# Altium schematic sheet DigitalPart.SchDoc: Плата АЦП - общая часть
size 330 x 381 mm; PageSetup: Record=PageOptions|CenterHorizontal=True|CenterVertical=True|PrintScale=0.82|XCorrection=1.00|YCorrection=1.00|PrintKind=2|BorderSize=5000000|LeftOffset=0|BottomOffset=0|Orientation=1|PaperLength=1000|PaperWidth=1000|Scale=100|PaperSource=7|PrintQuality=-4|MediaType=1|DitherType=10|PaperKind=A3|PrintScaleMode=1
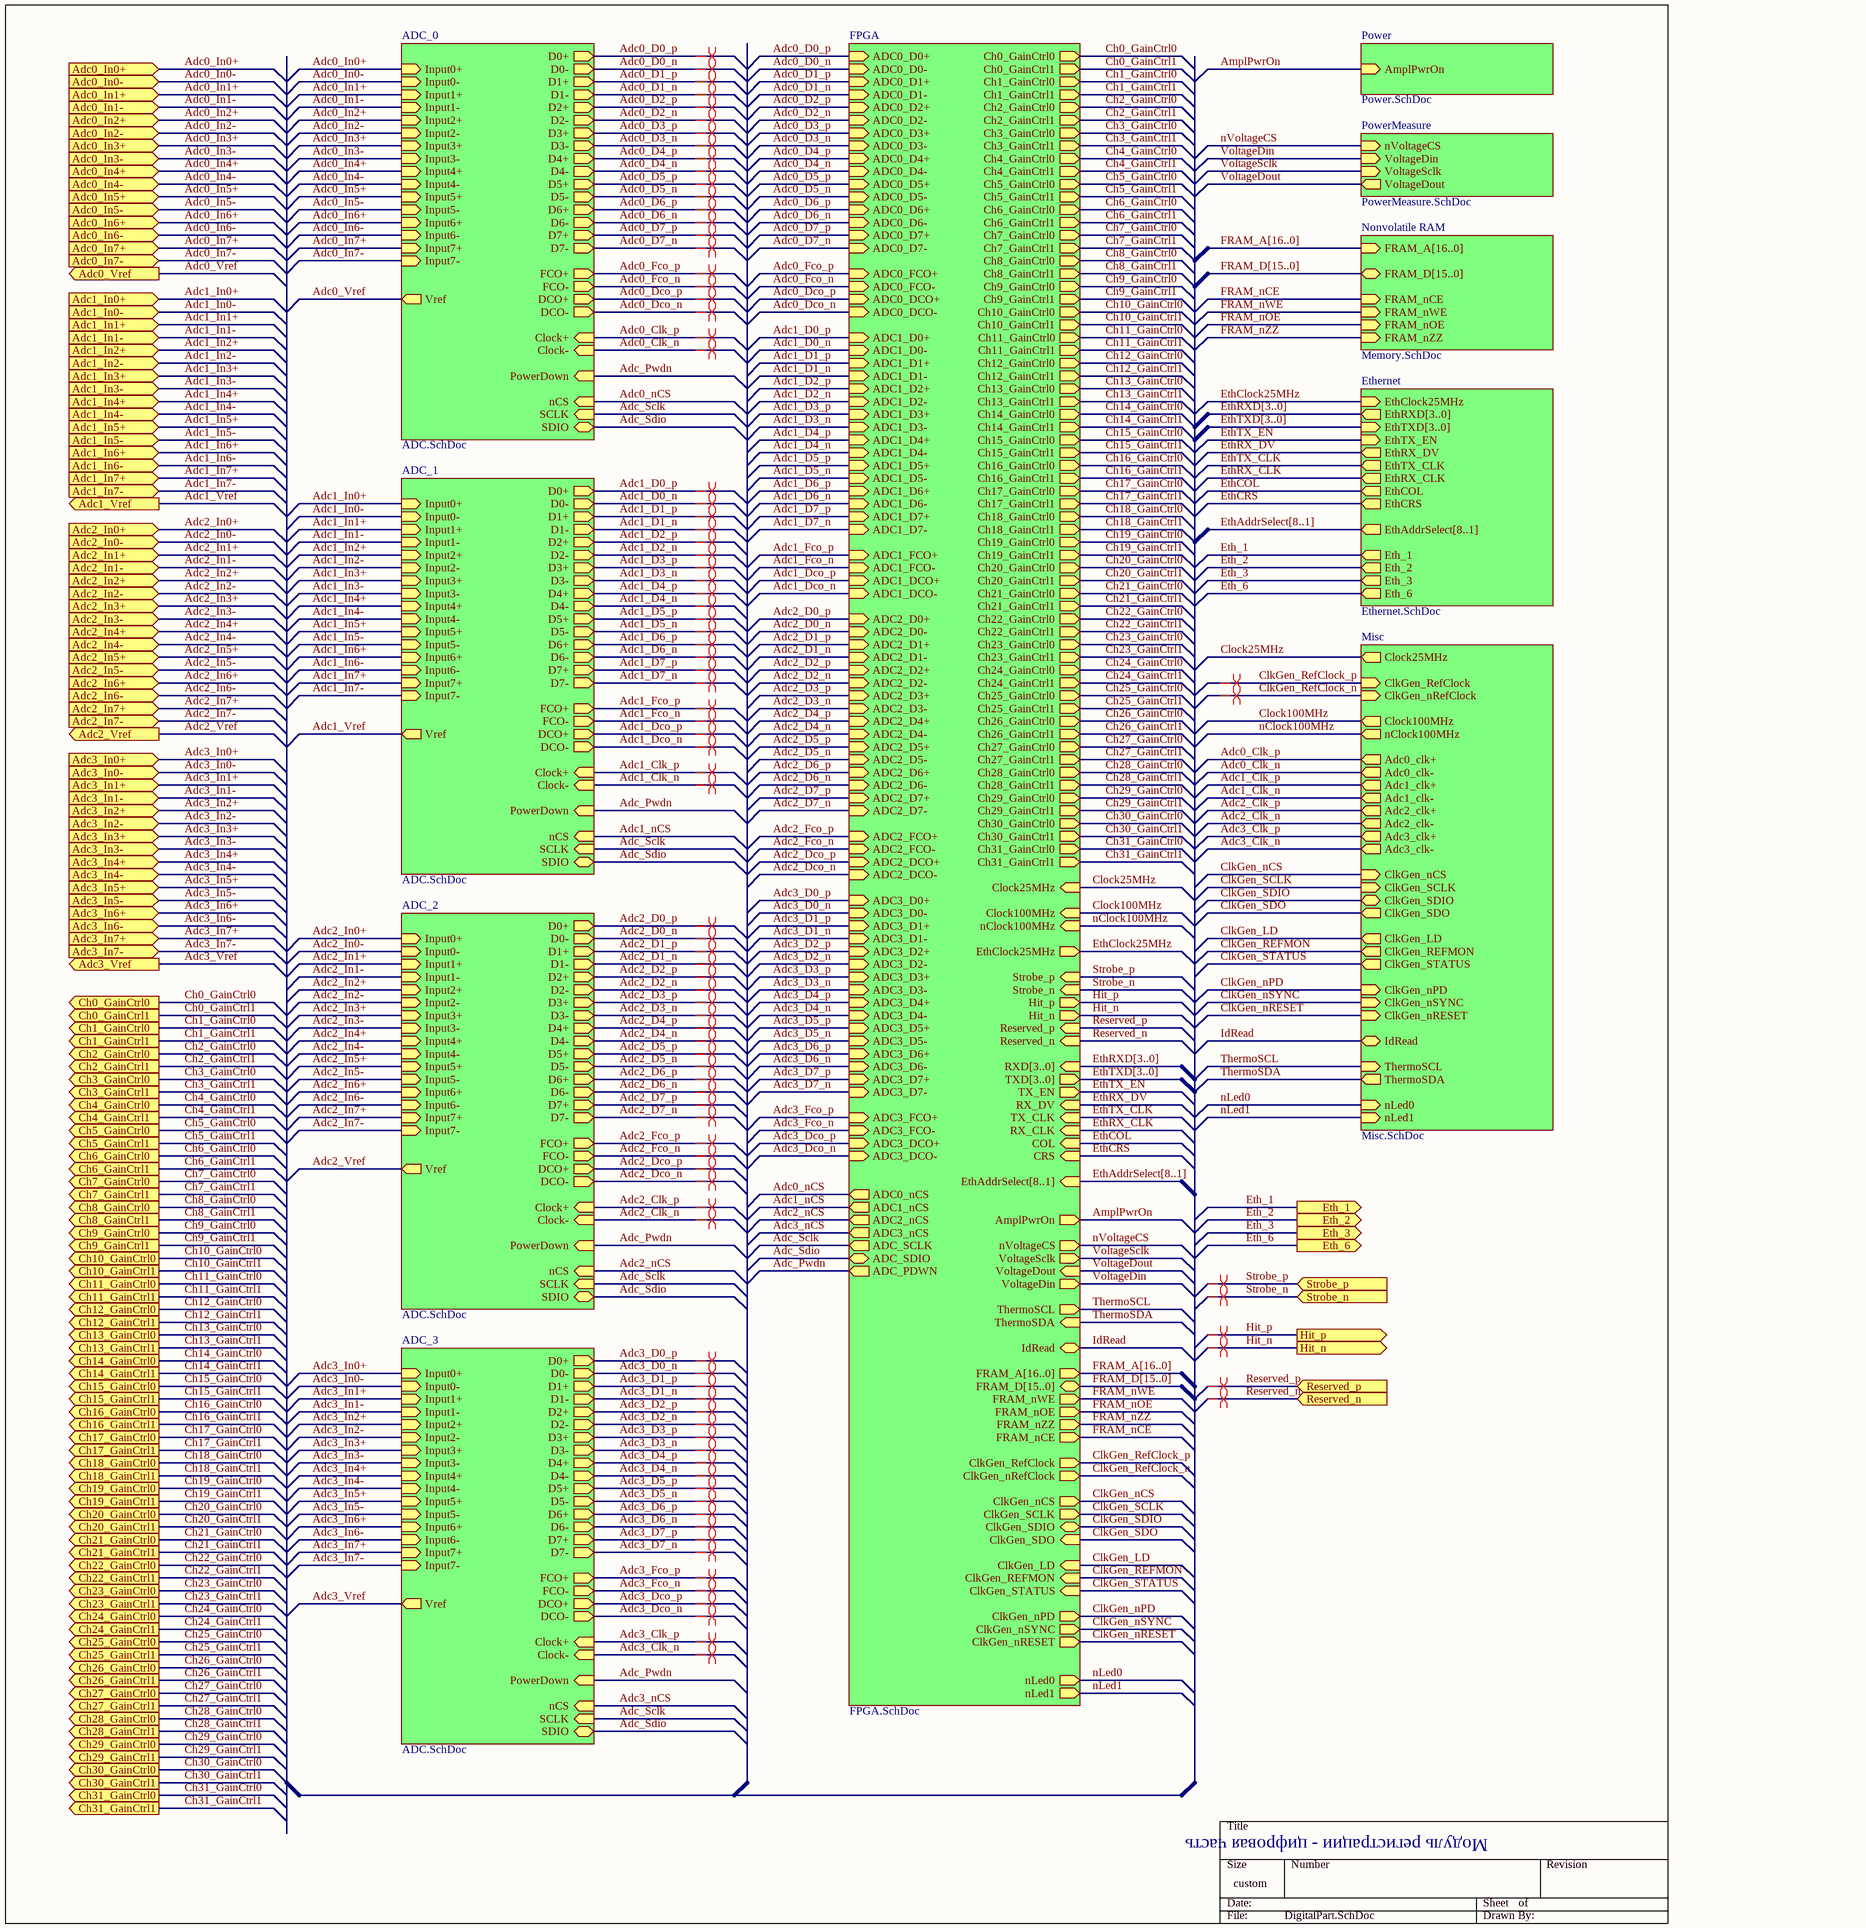
[diagram p0: DigitalPart.SchDoc]

## Sub-sheets
ADC_0 = ADC.SchDoc: Input3+ (in), Input3- (in), Input2- (in), Input2+ (in), Input1+ (in), Input1- (in), Input0- (in), Input0+ (in), Input4- (in), Input4+ (in), Input5+ (in), Input5- (in), Input6- (in), Input6+ (in), Input7+ (in), Input7- (in), PowerDown (in), D0+ (out), D0- (out), D1+ (out), D1- (out), D2+ (out), D2- (out), D3+ (out), D3- (out), FCO+ (out), FCO- (out), DCO+ (out), DCO- (out), D4+ (out), D4- (out), D5+ (out), D5- (out), D6+ (out), D6- (out), D7+ (out), D7- (out), Clock+ (in), Clock- (in), Vref (out), nCS (in), SDIO (bidir), SCLK (in)
ADC_1 = ADC.SchDoc: Input3+ (in), Input3- (in), Input2- (in), Input2+ (in), Input1+ (in), Input1- (in), Input0- (in), Input0+ (in), Input4- (in), Input4+ (in), Input5+ (in), Input5- (in), Input6- (in), Input6+ (in), Input7+ (in), Input7- (in), PowerDown (in), D0+ (out), D0- (out), D1+ (out), D1- (out), D2+ (out), D2- (out), D3+ (out), D3- (out), FCO+ (out), FCO- (out), DCO+ (out), DCO- (out), D4+ (out), D4- (out), D5+ (out), D5- (out), D6+ (out), D6- (out), D7+ (out), D7- (out), Clock+ (in), Clock- (in), Vref (out), nCS (in), SDIO (bidir), SCLK (in)
ADC_2 = ADC.SchDoc: Input3+ (in), Input3- (in), Input2- (in), Input2+ (in), Input1+ (in), Input1- (in), Input0- (in), Input0+ (in), Input4- (in), Input4+ (in), Input5+ (in), Input5- (in), Input6- (in), Input6+ (in), Input7+ (in), Input7- (in), PowerDown (in), D0+ (out), D0- (out), D1+ (out), D1- (out), D2+ (out), D2- (out), D3+ (out), D3- (out), FCO+ (out), FCO- (out), DCO+ (out), DCO- (out), D4+ (out), D4- (out), D5+ (out), D5- (out), D6+ (out), D6- (out), D7+ (out), D7- (out), Clock+ (in), Clock- (in), Vref (out), nCS (in), SDIO (bidir), SCLK (in)
ADC_3 = ADC.SchDoc: Input3+ (in), Input3- (in), Input2- (in), Input2+ (in), Input1+ (in), Input1- (in), Input0- (in), Input0+ (in), Input4- (in), Input4+ (in), Input5+ (in), Input5- (in), Input6- (in), Input6+ (in), Input7+ (in), Input7- (in), PowerDown (in), D0+ (out), D0- (out), D1+ (out), D1- (out), D2+ (out), D2- (out), D3+ (out), D3- (out), FCO+ (out), FCO- (out), DCO+ (out), DCO- (out), D4+ (out), D4- (out), D5+ (out), D5- (out), D6+ (out), D6- (out), D7+ (out), D7- (out), Clock+ (in), Clock- (in), Vref (out), nCS (in), SDIO (bidir), SCLK (in)
Ethernet = Ethernet.SchDoc: EthCOL (out), EthTX_EN (in), EthTX_CLK (out), EthRX_CLK (out), EthRX_DV (out), EthTXD[3..0] (in), EthRXD[3..0] (out), EthCRS (out), EthAddrSelect[8..1] (out), Eth_1 (out), Eth_2 (out), Eth_3 (out), Eth_6 (out), EthClock25MHz (in)
FPGA = FPGA.SchDoc: ADC0_D0+ (in), ADC0_D0- (in), ADC0_D1+ (in), ADC0_D2+ (in), ADC0_D3+ (in), ADC0_D4+ (in), ADC0_D5+ (in), ADC0_D6+ (in), ADC0_D7+ (in), ADC0_D1- (in), ADC0_D2- (in), ADC0_D3- (in), ADC0_D4- (in), ADC0_D5- (in), ADC0_D6- (in), ADC0_D7- (in), ADC0_DCO+ (in), ADC0_DCO- (in), ADC0_FCO+ (in), ADC0_FCO- (in), ADC1_D0+ (in), ADC1_D0- (in), ADC1_D1+ (in), ADC1_D2+ (in), ADC1_D3+ (in), ADC1_D4+ (in), ADC1_D5+ (in), ADC1_D6+ (in), ADC1_D7+ (in), ADC1_D1- (in), ADC1_D2- (in), ADC1_D3- (in), ADC1_D4- (in), ADC1_D5- (in), ADC1_D6- (in), ADC1_D7- (in), ADC1_DCO+ (in), ADC1_DCO- (in), ADC1_FCO+ (in), ADC1_FCO- (in), ADC_PDWN (out), ADC0_nCS (out), ADC1_nCS (out), ADC_SDIO (bidir), ADC_SCLK (out), AmplPwrOn (out), nVoltageCS (out), VoltageDin (out), VoltageSclk (out), VoltageDout (in), FRAM_A[16..0] (out), FRAM_nWE (out), FRAM_nOE (out), FRAM_nZZ (out), FRAM_nCE (out), FRAM_D[15..0] (bidir), IdRead (bidir), ThermoSDA (in), nClock100MHz (in), ThermoSCL (out), Strobe_n (in), ADC2_D0+ (in), ADC2_D0- (in), ADC2_D1+ (in), ADC2_D2+ (in), ADC2_D3+ (in), ADC2_D4+ (in), ADC2_D5+ (in), ADC2_D6+ (in), ADC2_D7+ (in), ADC2_D1- (in), ADC2_D2- (in), ADC2_D3- (in), ADC2_D4- (in), ADC2_D5- (in), ADC2_D6- (in), ADC2_D7- (in), ADC2_DCO+ (in), ADC2_DCO- (in), ADC2_FCO+ (in), ADC2_FCO- (in), ADC3_D0+ (in), ADC3_D0- (in), ADC3_D1+ (in), ADC3_D2+ (in), ADC3_D3+ (in), ADC3_D4+ (in), ADC3_D5+ (in), ADC3_D6+ (in), ADC3_D7+ (in), ADC3_D1- (in), ADC3_D2- (in), ADC3_D3- (in), ADC3_D4- (in), ADC3_D5- (in), ADC3_D6- (in), ADC3_D7- (in), ADC3_DCO+ (in), ADC3_DCO- (in), ADC3_FCO+ (in), ADC3_FCO- (in), ADC2_nCS (out), ADC3_nCS (out), Clock100MHz (in), Clock25MHz (in), Strobe_p (in), Hit_p (out), Hit_n (out), Reserved_p (in), Reserved_n (in), COL (in), TX_EN (out), TX_CLK (in), RX_CLK (in), RX_DV (in), TXD[3..0] (out), CRS (in), RXD[3..0] (in), EthAddrSelect[8..1] (in), Ch0_GainCtrl0 (out), Ch1_GainCtrl0 (out), Ch2_GainCtrl0 (out), Ch3_GainCtrl0 (out), Ch4_GainCtrl0 (out), Ch5_GainCtrl0 (out), Ch6_GainCtrl0 (out), Ch7_GainCtrl0 (out), Ch8_GainCtrl0 (out), Ch9_GainCtrl0 (out), Ch10_GainCtrl0 (out), Ch11_GainCtrl0 (out), Ch12_GainCtrl0 (out), Ch13_GainCtrl0 (out), Ch14_GainCtrl0 (out), Ch15_GainCtrl0 (out), Ch16_GainCtrl0 (out), Ch17_GainCtrl0 (out), Ch18_GainCtrl0 (out), Ch19_GainCtrl0 (out), Ch20_GainCtrl0 (out), Ch21_GainCtrl0 (out), Ch22_GainCtrl0 (out), Ch23_GainCtrl0 (out), Ch24_GainCtrl0 (out), Ch25_GainCtrl0 (out), Ch26_GainCtrl0 (out), Ch27_GainCtrl0 (out), Ch28_GainCtrl0 (out), Ch29_GainCtrl0 (out), Ch30_GainCtrl0 (out), Ch31_GainCtrl0 (out), Ch0_GainCtrl1 (out), Ch1_GainCtrl1 (out), Ch2_GainCtrl1 (out), Ch3_GainCtrl1 (out), Ch4_GainCtrl1 (out), Ch5_GainCtrl1 (out), Ch6_GainCtrl1 (out), Ch7_GainCtrl1 (out), Ch8_GainCtrl1 (out), Ch9_GainCtrl1 (out), Ch10_GainCtrl1 (out), Ch11_GainCtrl1 (out), Ch12_GainCtrl1 (out), Ch13_GainCtrl1 (out), Ch14_GainCtrl1 (out), Ch15_GainCtrl1 (out), Ch16_GainCtrl1 (out), Ch17_GainCtrl1 (out), Ch18_GainCtrl1 (out), Ch19_GainCtrl1 (out), Ch20_GainCtrl1 (out), Ch21_GainCtrl1 (out), Ch22_GainCtrl1 (out), Ch23_GainCtrl1 (out), Ch24_GainCtrl1 (out), Ch25_GainCtrl1 (out), Ch26_GainCtrl1 (out), Ch27_GainCtrl1 (out), Ch28_GainCtrl1 (out), Ch29_GainCtrl1 (out), Ch30_GainCtrl1 (out), Ch31_GainCtrl1 (out), EthClock25MHz (out), ClkGen_RefClock (out), ClkGen_nRefClock (out), ClkGen_SCLK (out), ClkGen_SDIO (bidir), ClkGen_SDO (in), ClkGen_nCS (out), ClkGen_nPD (out), ClkGen_nSYNC (out), ClkGen_nRESET (out), ClkGen_LD (in), ClkGen_REFMON (in), ClkGen_STATUS (in), nLed0 (out), nLed1 (out)
Misc = Misc.SchDoc: IdRead (bidir), ThermoSDA (out), ThermoSCL (in), Clock25MHz (out), Adc0_clk+ (out), Adc0_clk- (out), Adc1_clk+ (out), Adc1_clk- (out), Adc2_clk+ (out), Adc2_clk- (out), Adc3_clk+ (out), Adc3_clk- (out), Clock100MHz (out), nClock100MHz (out), ClkGen_RefClock (in), ClkGen_nRefClock (in), ClkGen_SCLK (in), ClkGen_SDIO (bidir), ClkGen_SDO (out), ClkGen_nCS (in), ClkGen_LD (out), ClkGen_REFMON (out), ClkGen_STATUS (out), ClkGen_nPD (in), ClkGen_nSYNC (in), ClkGen_nRESET (in), nLed0 (in), nLed1 (in)
Nonvolatile RAM = Memory.SchDoc: FRAM_A[16..0] (in), FRAM_nWE (in), FRAM_nOE (in), FRAM_nZZ (in), FRAM_D[15..0] (bidir), FRAM_nCE (in)
Power = Power.SchDoc: AmplPwrOn (in)
PowerMeasure = PowerMeasure.SchDoc: nVoltageCS (in), VoltageDin (in), VoltageSclk (in), VoltageDout (out)

## Ports
Adc0_In0+ (in), Adc0_In0- (in), Adc0_In1+ (in), Adc0_In1- (in), Adc0_In2+ (in), Adc0_In2- (in), Adc0_In3+ (in), Adc0_In3- (in), Adc0_In4+ (in), Adc0_In4- (in), Adc0_In5+ (in), Adc0_In5- (in), Adc0_In6+ (in), Adc0_In6- (in), Adc0_In7+ (in), Adc0_In7- (in), Adc0_Vref (out), Adc1_In0+ (in), Adc1_In0- (in), Adc1_In1+ (in), Adc1_In1- (in), Adc1_In2+ (in), Adc1_In2- (in), Adc1_In3+ (in), Adc1_In3- (in), Adc1_In4+ (in), Adc1_In4- (in), Adc1_In5+ (in), Adc1_In5- (in), Adc1_In6+ (in), Adc1_In6- (in), Adc1_In7+ (in), Adc1_In7- (in), Adc1_Vref (out), Adc2_In0+ (in), Adc2_In0- (in), Adc2_In1+ (in), Adc2_In1- (in), Adc2_In2+ (in), Adc2_In2- (in), Adc2_In3+ (in), Adc2_In3- (in), Adc2_In4+ (in), Adc2_In4- (in), Adc2_In5+ (in), Adc2_In5- (in), Adc2_In6+ (in), Adc2_In6- (in), Adc2_In7+ (in), Adc2_In7- (in), Adc2_Vref (out), Adc3_In0+ (in), Adc3_In0- (in), Adc3_In1+ (in), Adc3_In1- (in), Adc3_In2+ (in), Adc3_In2- (in), Adc3_In3+ (in), Adc3_In3- (in), Adc3_In4+ (in), Adc3_In4- (in), Adc3_In5+ (in), Adc3_In5- (in), Adc3_In6+ (in), Adc3_In6- (in), Adc3_In7+ (in), Adc3_In7- (in), Adc3_Vref (out), Ch0_GainCtrl0 (out), Ch0_GainCtrl1 (out), Ch1_GainCtrl0 (out), Ch1_GainCtrl1 (out), Ch2_GainCtrl0 (out), Ch2_GainCtrl1 (out), Ch3_GainCtrl0 (out), Ch3_GainCtrl1 (out), Ch4_GainCtrl0 (out), Ch4_GainCtrl1 (out), Ch5_GainCtrl0 (out), Ch5_GainCtrl1 (out), Ch6_GainCtrl0 (out), Ch6_GainCtrl1 (out), Ch7_GainCtrl0 (out), Ch7_GainCtrl1 (out), Ch8_GainCtrl0 (out), Ch8_GainCtrl1 (out), Ch9_GainCtrl0 (out), Ch9_GainCtrl1 (out), Ch10_GainCtrl0 (out), Ch10_GainCtrl1 (out), Ch11_GainCtrl0 (out), Ch11_GainCtrl1 (out), Ch12_GainCtrl0 (out), Ch12_GainCtrl1 (out), Ch13_GainCtrl0 (out), Ch13_GainCtrl1 (out), Ch14_GainCtrl0 (out), Ch14_GainCtrl1 (out), Ch15_GainCtrl0 (out), Ch15_GainCtrl1 (out), Ch16_GainCtrl0 (out), Ch16_GainCtrl1 (out), Ch17_GainCtrl0 (out), Ch17_GainCtrl1 (out), Ch18_GainCtrl0 (out), Ch18_GainCtrl1 (out), Ch19_GainCtrl0 (out), Ch19_GainCtrl1 (out), Ch20_GainCtrl0 (out), Ch20_GainCtrl1 (out), Ch21_GainCtrl0 (out), Ch21_GainCtrl1 (out), Ch22_GainCtrl0 (out), Ch22_GainCtrl1 (out), Ch23_GainCtrl0 (out), Ch23_GainCtrl1 (out), Ch24_GainCtrl0 (out), Ch24_GainCtrl1 (out), Ch25_GainCtrl0 (out), Ch25_GainCtrl1 (out), Ch26_GainCtrl0 (out), Ch26_GainCtrl1 (out), Ch27_GainCtrl0 (out), Ch27_GainCtrl1 (out), Ch28_GainCtrl0 (out), Ch28_GainCtrl1 (out), Ch29_GainCtrl0 (out), Ch29_GainCtrl1 (out), Ch30_GainCtrl0 (out), Ch30_GainCtrl1 (out), Ch31_GainCtrl0 (out), Ch31_GainCtrl1 (out), Eth_1 (out), Eth_2 (out), Eth_3 (out), Eth_6 (out), Hit_n (out), Hit_p (out), Reserved_n (in), Reserved_p (in), Strobe_n (in), Strobe_p (in)

## Nets
Adc0_Clk_n: sheet Misc/Adc0_clk-, sheet ADC_0/Clock-
Adc0_Clk_p: sheet Misc/Adc0_clk+, sheet ADC_0/Clock+
Adc0_D0_n: sheet ADC_0/D0-, sheet FPGA/ADC0_D0-
Adc0_D0_p: sheet ADC_0/D0+, sheet FPGA/ADC0_D0+
Adc0_D1_n: sheet ADC_0/D1-, sheet FPGA/ADC0_D1-
Adc0_D1_p: sheet ADC_0/D1+, sheet FPGA/ADC0_D1+
Adc0_D2_n: sheet ADC_0/D2-, sheet FPGA/ADC0_D2-
Adc0_D2_p: sheet ADC_0/D2+, sheet FPGA/ADC0_D2+
Adc0_D3_n: sheet ADC_0/D3-, sheet FPGA/ADC0_D3-
Adc0_D3_p: sheet ADC_0/D3+, sheet FPGA/ADC0_D3+
Adc0_D4_n: sheet ADC_0/D4-, sheet FPGA/ADC0_D4-
Adc0_D4_p: sheet ADC_0/D4+, sheet FPGA/ADC0_D4+
Adc0_D5_n: sheet ADC_0/D5-, sheet FPGA/ADC0_D5-
Adc0_D5_p: sheet ADC_0/D5+, sheet FPGA/ADC0_D5+
Adc0_D6_n: sheet ADC_0/D6-, sheet FPGA/ADC0_D6-
Adc0_D6_p: sheet ADC_0/D6+, sheet FPGA/ADC0_D6+
Adc0_D7_n: sheet ADC_0/D7-, sheet FPGA/ADC0_D7-
Adc0_D7_p: sheet ADC_0/D7+, sheet FPGA/ADC0_D7+
Adc0_Dco_n: sheet ADC_0/DCO-, sheet FPGA/ADC0_DCO-
Adc0_Dco_p: sheet ADC_0/DCO+, sheet FPGA/ADC0_DCO+
Adc0_Fco_n: sheet ADC_0/FCO-, sheet FPGA/ADC0_FCO-
Adc0_Fco_p: sheet ADC_0/FCO+, sheet FPGA/ADC0_FCO+
Adc0_In0+: port Adc0_In0+, sheet ADC_0/Input0+
Adc0_In0-: port Adc0_In0-, sheet ADC_0/Input0-
Adc0_In1+: port Adc0_In1+, sheet ADC_0/Input1+
Adc0_In1-: port Adc0_In1-, sheet ADC_0/Input1-
Adc0_In2+: port Adc0_In2+, sheet ADC_0/Input2+
Adc0_In2-: port Adc0_In2-, sheet ADC_0/Input2-
Adc0_In3+: port Adc0_In3+, sheet ADC_0/Input3+
Adc0_In3-: port Adc0_In3-, sheet ADC_0/Input3-
Adc0_In4+: port Adc0_In4+, sheet ADC_0/Input4+
Adc0_In4-: port Adc0_In4-, sheet ADC_0/Input4-
Adc0_In5+: port Adc0_In5+, sheet ADC_0/Input5+
Adc0_In5-: port Adc0_In5-, sheet ADC_0/Input5-
Adc0_In6+: port Adc0_In6+, sheet ADC_0/Input6+
Adc0_In6-: port Adc0_In6-, sheet ADC_0/Input6-
Adc0_In7+: port Adc0_In7+, sheet ADC_0/Input7+
Adc0_In7-: port Adc0_In7-, sheet ADC_0/Input7-
Adc0_nCS: sheet ADC_0/nCS, sheet FPGA/ADC0_nCS
Adc0_Vref: port Adc0_Vref, sheet ADC_0/Vref
Adc1_Clk_n: sheet Misc/Adc1_clk-, sheet ADC_1/Clock-
Adc1_Clk_p: sheet Misc/Adc1_clk+, sheet ADC_1/Clock+
Adc1_D0_n: sheet ADC_1/D0-, sheet FPGA/ADC1_D0-
Adc1_D0_p: sheet ADC_1/D0+, sheet FPGA/ADC1_D0+
Adc1_D1_n: sheet ADC_1/D1-, sheet FPGA/ADC1_D1-
Adc1_D1_p: sheet ADC_1/D1+, sheet FPGA/ADC1_D1+
Adc1_D2_n: sheet ADC_1/D2-, sheet FPGA/ADC1_D2-
Adc1_D2_p: sheet ADC_1/D2+, sheet FPGA/ADC1_D2+
Adc1_D3_n: sheet ADC_1/D3-, sheet FPGA/ADC1_D3-
Adc1_D3_p: sheet ADC_1/D3+, sheet FPGA/ADC1_D3+
Adc1_D4_n: sheet ADC_1/D4-, sheet FPGA/ADC1_D4-
Adc1_D4_p: sheet ADC_1/D4+, sheet FPGA/ADC1_D4+
Adc1_D5_n: sheet ADC_1/D5-, sheet FPGA/ADC1_D5-
Adc1_D5_p: sheet ADC_1/D5+, sheet FPGA/ADC1_D5+
Adc1_D6_n: sheet ADC_1/D6-, sheet FPGA/ADC1_D6-
Adc1_D6_p: sheet ADC_1/D6+, sheet FPGA/ADC1_D6+
Adc1_D7_n: sheet ADC_1/D7-, sheet FPGA/ADC1_D7-
Adc1_D7_p: sheet ADC_1/D7+, sheet FPGA/ADC1_D7+
Adc1_Dco_n: sheet ADC_1/DCO-, sheet FPGA/ADC1_DCO-
Adc1_Dco_p: sheet ADC_1/DCO+, sheet FPGA/ADC1_DCO+
Adc1_Fco_n: sheet ADC_1/FCO-, sheet FPGA/ADC1_FCO-
Adc1_Fco_p: sheet ADC_1/FCO+, sheet FPGA/ADC1_FCO+
Adc1_In0+: port Adc1_In0+, sheet ADC_1/Input0+
Adc1_In0-: port Adc1_In0-, sheet ADC_1/Input0-
Adc1_In1+: port Adc1_In1+, sheet ADC_1/Input1+
Adc1_In1-: port Adc1_In1-, sheet ADC_1/Input1-
Adc1_In2+: port Adc1_In2+, sheet ADC_1/Input2+
Adc1_In2-: port Adc1_In2-, sheet ADC_1/Input2-
Adc1_In3+: port Adc1_In3+, sheet ADC_1/Input3+
Adc1_In3-: port Adc1_In3-, sheet ADC_1/Input3-
Adc1_In4+: port Adc1_In4+, sheet ADC_1/Input4+
Adc1_In4-: port Adc1_In4-, sheet ADC_1/Input4-
Adc1_In5+: port Adc1_In5+, sheet ADC_1/Input5+
Adc1_In5-: port Adc1_In5-, sheet ADC_1/Input5-
Adc1_In6+: port Adc1_In6+, sheet ADC_1/Input6+
Adc1_In6-: port Adc1_In6-, sheet ADC_1/Input6-
Adc1_In7+: port Adc1_In7+, sheet ADC_1/Input7+
Adc1_In7-: port Adc1_In7-, sheet ADC_1/Input7-
Adc1_nCS: sheet ADC_1/nCS, sheet FPGA/ADC1_nCS
Adc1_Vref: port Adc1_Vref, sheet ADC_1/Vref
Adc2_Clk_n: sheet Misc/Adc2_clk-, sheet ADC_2/Clock-
Adc2_Clk_p: sheet Misc/Adc2_clk+, sheet ADC_2/Clock+
Adc2_D0_n: sheet ADC_2/D0-, sheet FPGA/ADC2_D0-
Adc2_D0_p: sheet ADC_2/D0+, sheet FPGA/ADC2_D0+
Adc2_D1_n: sheet ADC_2/D1-, sheet FPGA/ADC2_D1-
Adc2_D1_p: sheet ADC_2/D1+, sheet FPGA/ADC2_D1+
Adc2_D2_n: sheet ADC_2/D2-, sheet FPGA/ADC2_D2-
Adc2_D2_p: sheet ADC_2/D2+, sheet FPGA/ADC2_D2+
Adc2_D3_n: sheet ADC_2/D3-, sheet FPGA/ADC2_D3-
Adc2_D3_p: sheet ADC_2/D3+, sheet FPGA/ADC2_D3+
Adc2_D4_n: sheet ADC_2/D4-, sheet FPGA/ADC2_D4-
Adc2_D4_p: sheet ADC_2/D4+, sheet FPGA/ADC2_D4+
Adc2_D5_n: sheet ADC_2/D5-, sheet FPGA/ADC2_D5-
Adc2_D5_p: sheet ADC_2/D5+, sheet FPGA/ADC2_D5+
Adc2_D6_n: sheet ADC_2/D6-, sheet FPGA/ADC2_D6-
Adc2_D6_p: sheet ADC_2/D6+, sheet FPGA/ADC2_D6+
Adc2_D7_n: sheet ADC_2/D7-, sheet FPGA/ADC2_D7-
Adc2_D7_p: sheet ADC_2/D7+, sheet FPGA/ADC2_D7+
Adc2_Dco_n: sheet ADC_2/DCO-, sheet FPGA/ADC2_DCO-
Adc2_Dco_p: sheet ADC_2/DCO+, sheet FPGA/ADC2_DCO+
Adc2_Fco_n: sheet ADC_2/FCO-, sheet FPGA/ADC2_FCO-
Adc2_Fco_p: sheet ADC_2/FCO+, sheet FPGA/ADC2_FCO+
Adc2_In0+: port Adc2_In0+, sheet ADC_2/Input0+
Adc2_In0-: port Adc2_In0-, sheet ADC_2/Input0-
Adc2_In1+: port Adc2_In1+, sheet ADC_2/Input1+
Adc2_In1-: port Adc2_In1-, sheet ADC_2/Input1-
Adc2_In2+: port Adc2_In2+, sheet ADC_2/Input2+
Adc2_In2-: port Adc2_In2-, sheet ADC_2/Input2-
Adc2_In3+: port Adc2_In3+, sheet ADC_2/Input3+
Adc2_In3-: port Adc2_In3-, sheet ADC_2/Input3-
Adc2_In4+: port Adc2_In4+, sheet ADC_2/Input4+
Adc2_In4-: port Adc2_In4-, sheet ADC_2/Input4-
Adc2_In5+: port Adc2_In5+, sheet ADC_2/Input5+
Adc2_In5-: port Adc2_In5-, sheet ADC_2/Input5-
Adc2_In6+: port Adc2_In6+, sheet ADC_2/Input6+
Adc2_In6-: port Adc2_In6-, sheet ADC_2/Input6-
Adc2_In7+: port Adc2_In7+, sheet ADC_2/Input7+
Adc2_In7-: port Adc2_In7-, sheet ADC_2/Input7-
Adc2_nCS: sheet ADC_2/nCS, sheet FPGA/ADC2_nCS
Adc2_Vref: port Adc2_Vref, sheet ADC_2/Vref
Adc3_Clk_n: sheet Misc/Adc3_clk-, sheet ADC_3/Clock-
Adc3_Clk_p: sheet Misc/Adc3_clk+, sheet ADC_3/Clock+
Adc3_D0_n: sheet ADC_3/D0-, sheet FPGA/ADC3_D0-
Adc3_D0_p: sheet ADC_3/D0+, sheet FPGA/ADC3_D0+
Adc3_D1_n: sheet ADC_3/D1-, sheet FPGA/ADC3_D1-
Adc3_D1_p: sheet ADC_3/D1+, sheet FPGA/ADC3_D1+
Adc3_D2_n: sheet ADC_3/D2-, sheet FPGA/ADC3_D2-
Adc3_D2_p: sheet ADC_3/D2+, sheet FPGA/ADC3_D2+
Adc3_D3_n: sheet ADC_3/D3-, sheet FPGA/ADC3_D3-
Adc3_D3_p: sheet ADC_3/D3+, sheet FPGA/ADC3_D3+
Adc3_D4_n: sheet ADC_3/D4-, sheet FPGA/ADC3_D4-
Adc3_D4_p: sheet ADC_3/D4+, sheet FPGA/ADC3_D4+
Adc3_D5_n: sheet ADC_3/D5-, sheet FPGA/ADC3_D5-
Adc3_D5_p: sheet ADC_3/D5+, sheet FPGA/ADC3_D5+
Adc3_D6_n: sheet ADC_3/D6-, sheet FPGA/ADC3_D6-
Adc3_D6_p: sheet ADC_3/D6+, sheet FPGA/ADC3_D6+
Adc3_D7_n: sheet ADC_3/D7-, sheet FPGA/ADC3_D7-
Adc3_D7_p: sheet ADC_3/D7+, sheet FPGA/ADC3_D7+
Adc3_Dco_n: sheet ADC_3/DCO-, sheet FPGA/ADC3_DCO-
Adc3_Dco_p: sheet ADC_3/DCO+, sheet FPGA/ADC3_DCO+
Adc3_Fco_n: sheet ADC_3/FCO-, sheet FPGA/ADC3_FCO-
Adc3_Fco_p: sheet ADC_3/FCO+, sheet FPGA/ADC3_FCO+
Adc3_In0+: port Adc3_In0+, sheet ADC_3/Input0+
Adc3_In0-: port Adc3_In0-, sheet ADC_3/Input0-
Adc3_In1+: port Adc3_In1+, sheet ADC_3/Input1+
Adc3_In1-: port Adc3_In1-, sheet ADC_3/Input1-
Adc3_In2+: port Adc3_In2+, sheet ADC_3/Input2+
Adc3_In2-: port Adc3_In2-, sheet ADC_3/Input2-
Adc3_In3+: port Adc3_In3+, sheet ADC_3/Input3+
Adc3_In3-: port Adc3_In3-, sheet ADC_3/Input3-
Adc3_In4+: port Adc3_In4+, sheet ADC_3/Input4+
Adc3_In4-: port Adc3_In4-, sheet ADC_3/Input4-
Adc3_In5+: port Adc3_In5+, sheet ADC_3/Input5+
Adc3_In5-: port Adc3_In5-, sheet ADC_3/Input5-
Adc3_In6+: port Adc3_In6+, sheet ADC_3/Input6+
Adc3_In6-: port Adc3_In6-, sheet ADC_3/Input6-
Adc3_In7+: port Adc3_In7+, sheet ADC_3/Input7+
Adc3_In7-: port Adc3_In7-, sheet ADC_3/Input7-
Adc3_nCS: sheet ADC_3/nCS, sheet FPGA/ADC3_nCS
Adc3_Vref: port Adc3_Vref, sheet ADC_3/Vref
Adc_Pwdn: sheet ADC_0/PowerDown, sheet ADC_1/PowerDown, sheet ADC_2/PowerDown, sheet ADC_3/PowerDown, sheet FPGA/ADC_PDWN
Adc_Sclk: sheet ADC_0/SCLK, sheet ADC_1/SCLK, sheet ADC_2/SCLK, sheet ADC_3/SCLK, sheet FPGA/ADC_SCLK
Adc_Sdio: sheet ADC_0/SDIO, sheet ADC_1/SDIO, sheet ADC_2/SDIO, sheet ADC_3/SDIO, sheet FPGA/ADC_SDIO
AmplPwrOn: sheet Power/AmplPwrOn, sheet FPGA/AmplPwrOn
Ch0_GainCtrl0: port Ch0_GainCtrl0, sheet FPGA/Ch0_GainCtrl0
Ch0_GainCtrl1: port Ch0_GainCtrl1, sheet FPGA/Ch0_GainCtrl1
Ch1_GainCtrl0: port Ch1_GainCtrl0, sheet FPGA/Ch1_GainCtrl0
Ch1_GainCtrl1: port Ch1_GainCtrl1, sheet FPGA/Ch1_GainCtrl1
Ch2_GainCtrl0: port Ch2_GainCtrl0, sheet FPGA/Ch2_GainCtrl0
Ch2_GainCtrl1: port Ch2_GainCtrl1, sheet FPGA/Ch2_GainCtrl1
Ch3_GainCtrl0: port Ch3_GainCtrl0, sheet FPGA/Ch3_GainCtrl0
Ch3_GainCtrl1: port Ch3_GainCtrl1, sheet FPGA/Ch3_GainCtrl1
Ch4_GainCtrl0: port Ch4_GainCtrl0, sheet FPGA/Ch4_GainCtrl0
Ch4_GainCtrl1: port Ch4_GainCtrl1, sheet FPGA/Ch4_GainCtrl1
Ch5_GainCtrl0: port Ch5_GainCtrl0, sheet FPGA/Ch5_GainCtrl0
Ch5_GainCtrl1: port Ch5_GainCtrl1, sheet FPGA/Ch5_GainCtrl1
Ch6_GainCtrl0: port Ch6_GainCtrl0, sheet FPGA/Ch6_GainCtrl0
Ch6_GainCtrl1: port Ch6_GainCtrl1, sheet FPGA/Ch6_GainCtrl1
Ch7_GainCtrl0: port Ch7_GainCtrl0, sheet FPGA/Ch7_GainCtrl0
Ch7_GainCtrl1: port Ch7_GainCtrl1, sheet FPGA/Ch7_GainCtrl1
Ch8_GainCtrl0: port Ch8_GainCtrl0, sheet FPGA/Ch8_GainCtrl0
Ch8_GainCtrl1: port Ch8_GainCtrl1, sheet FPGA/Ch8_GainCtrl1
Ch9_GainCtrl0: port Ch9_GainCtrl0, sheet FPGA/Ch9_GainCtrl0
Ch9_GainCtrl1: port Ch9_GainCtrl1, sheet FPGA/Ch9_GainCtrl1
Ch10_GainCtrl0: port Ch10_GainCtrl0, sheet FPGA/Ch10_GainCtrl0
Ch10_GainCtrl1: port Ch10_GainCtrl1, sheet FPGA/Ch10_GainCtrl1
Ch11_GainCtrl0: port Ch11_GainCtrl0, sheet FPGA/Ch11_GainCtrl0
Ch11_GainCtrl1: port Ch11_GainCtrl1, sheet FPGA/Ch11_GainCtrl1
Ch12_GainCtrl0: port Ch12_GainCtrl0, sheet FPGA/Ch12_GainCtrl0
Ch12_GainCtrl1: port Ch12_GainCtrl1, sheet FPGA/Ch12_GainCtrl1
Ch13_GainCtrl0: port Ch13_GainCtrl0, sheet FPGA/Ch13_GainCtrl0
Ch13_GainCtrl1: port Ch13_GainCtrl1, sheet FPGA/Ch13_GainCtrl1
Ch14_GainCtrl0: port Ch14_GainCtrl0, sheet FPGA/Ch14_GainCtrl0
Ch14_GainCtrl1: port Ch14_GainCtrl1, sheet FPGA/Ch14_GainCtrl1
Ch15_GainCtrl0: port Ch15_GainCtrl0, sheet FPGA/Ch15_GainCtrl0
Ch15_GainCtrl1: port Ch15_GainCtrl1, sheet FPGA/Ch15_GainCtrl1
Ch16_GainCtrl0: port Ch16_GainCtrl0, sheet FPGA/Ch16_GainCtrl0
Ch16_GainCtrl1: port Ch16_GainCtrl1, sheet FPGA/Ch16_GainCtrl1
Ch17_GainCtrl0: port Ch17_GainCtrl0, sheet FPGA/Ch17_GainCtrl0
Ch17_GainCtrl1: port Ch17_GainCtrl1, sheet FPGA/Ch17_GainCtrl1
Ch18_GainCtrl0: port Ch18_GainCtrl0, sheet FPGA/Ch18_GainCtrl0
Ch18_GainCtrl1: port Ch18_GainCtrl1, sheet FPGA/Ch18_GainCtrl1
Ch19_GainCtrl0: port Ch19_GainCtrl0, sheet FPGA/Ch19_GainCtrl0
Ch19_GainCtrl1: port Ch19_GainCtrl1, sheet FPGA/Ch19_GainCtrl1
Ch20_GainCtrl0: port Ch20_GainCtrl0, sheet FPGA/Ch20_GainCtrl0
Ch20_GainCtrl1: port Ch20_GainCtrl1, sheet FPGA/Ch20_GainCtrl1
Ch21_GainCtrl0: port Ch21_GainCtrl0, sheet FPGA/Ch21_GainCtrl0
Ch21_GainCtrl1: port Ch21_GainCtrl1, sheet FPGA/Ch21_GainCtrl1
Ch22_GainCtrl0: port Ch22_GainCtrl0, sheet FPGA/Ch22_GainCtrl0
Ch22_GainCtrl1: port Ch22_GainCtrl1, sheet FPGA/Ch22_GainCtrl1
Ch23_GainCtrl0: port Ch23_GainCtrl0, sheet FPGA/Ch23_GainCtrl0
Ch23_GainCtrl1: port Ch23_GainCtrl1, sheet FPGA/Ch23_GainCtrl1
Ch24_GainCtrl0: port Ch24_GainCtrl0, sheet FPGA/Ch24_GainCtrl0
Ch24_GainCtrl1: port Ch24_GainCtrl1, sheet FPGA/Ch24_GainCtrl1
Ch25_GainCtrl0: port Ch25_GainCtrl0, sheet FPGA/Ch25_GainCtrl0
Ch25_GainCtrl1: port Ch25_GainCtrl1, sheet FPGA/Ch25_GainCtrl1
Ch26_GainCtrl0: port Ch26_GainCtrl0, sheet FPGA/Ch26_GainCtrl0
Ch26_GainCtrl1: port Ch26_GainCtrl1, sheet FPGA/Ch26_GainCtrl1
Ch27_GainCtrl0: port Ch27_GainCtrl0, sheet FPGA/Ch27_GainCtrl0
Ch27_GainCtrl1: port Ch27_GainCtrl1, sheet FPGA/Ch27_GainCtrl1
Ch28_GainCtrl0: port Ch28_GainCtrl0, sheet FPGA/Ch28_GainCtrl0
Ch28_GainCtrl1: port Ch28_GainCtrl1, sheet FPGA/Ch28_GainCtrl1
Ch29_GainCtrl0: port Ch29_GainCtrl0, sheet FPGA/Ch29_GainCtrl0
Ch29_GainCtrl1: port Ch29_GainCtrl1, sheet FPGA/Ch29_GainCtrl1
Ch30_GainCtrl0: port Ch30_GainCtrl0, sheet FPGA/Ch30_GainCtrl0
Ch30_GainCtrl1: port Ch30_GainCtrl1, sheet FPGA/Ch30_GainCtrl1
Ch31_GainCtrl0: port Ch31_GainCtrl0, sheet FPGA/Ch31_GainCtrl0
Ch31_GainCtrl1: port Ch31_GainCtrl1, sheet FPGA/Ch31_GainCtrl1
ClkGen_LD: sheet Misc/ClkGen_LD, sheet FPGA/ClkGen_LD
ClkGen_nCS: sheet Misc/ClkGen_nCS, sheet FPGA/ClkGen_nCS
ClkGen_nPD: sheet Misc/ClkGen_nPD, sheet FPGA/ClkGen_nPD
ClkGen_nRESET: sheet Misc/ClkGen_nRESET, sheet FPGA/ClkGen_nRESET
ClkGen_nSYNC: sheet Misc/ClkGen_nSYNC, sheet FPGA/ClkGen_nSYNC
ClkGen_RefClock_n: sheet Misc/ClkGen_nRefClock, sheet FPGA/ClkGen_nRefClock
ClkGen_RefClock_p: sheet Misc/ClkGen_RefClock, sheet FPGA/ClkGen_RefClock
ClkGen_REFMON: sheet Misc/ClkGen_REFMON, sheet FPGA/ClkGen_REFMON
ClkGen_SCLK: sheet Misc/ClkGen_SCLK, sheet FPGA/ClkGen_SCLK
ClkGen_SDIO: sheet Misc/ClkGen_SDIO, sheet FPGA/ClkGen_SDIO
ClkGen_SDO: sheet Misc/ClkGen_SDO, sheet FPGA/ClkGen_SDO
ClkGen_STATUS: sheet Misc/ClkGen_STATUS, sheet FPGA/ClkGen_STATUS
Clock25MHz: sheet Misc/Clock25MHz, sheet FPGA/Clock25MHz
Clock100MHz: sheet Misc/Clock100MHz, sheet FPGA/Clock100MHz
Eth_1: port Eth_1, sheet Ethernet/Eth_1
Eth_2: port Eth_2, sheet Ethernet/Eth_2
Eth_3: port Eth_3, sheet Ethernet/Eth_3
Eth_6: port Eth_6, sheet Ethernet/Eth_6
EthClock25MHz: sheet FPGA/EthClock25MHz, sheet Ethernet/EthClock25MHz
EthCOL: sheet FPGA/COL, sheet Ethernet/EthCOL
EthCRS: sheet FPGA/CRS, sheet Ethernet/EthCRS
EthRX_CLK: sheet FPGA/RX_CLK, sheet Ethernet/EthRX_CLK
EthRX_DV: sheet FPGA/RX_DV, sheet Ethernet/EthRX_DV
EthTX_CLK: sheet FPGA/TX_CLK, sheet Ethernet/EthTX_CLK
EthTX_EN: sheet FPGA/TX_EN, sheet Ethernet/EthTX_EN
FRAM_nCE: sheet Nonvolatile RAM/FRAM_nCE, sheet FPGA/FRAM_nCE
FRAM_nOE: sheet Nonvolatile RAM/FRAM_nOE, sheet FPGA/FRAM_nOE
FRAM_nWE: sheet Nonvolatile RAM/FRAM_nWE, sheet FPGA/FRAM_nWE
FRAM_nZZ: sheet Nonvolatile RAM/FRAM_nZZ, sheet FPGA/FRAM_nZZ
Hit_n: port Hit_n, sheet FPGA/Hit_n
Hit_p: port Hit_p, sheet FPGA/Hit_p
IdRead: sheet Misc/IdRead, sheet FPGA/IdRead
nClock100MHz: sheet Misc/nClock100MHz, sheet FPGA/nClock100MHz
nLed0: sheet Misc/nLed0, sheet FPGA/nLed0
nLed1: sheet Misc/nLed1, sheet FPGA/nLed1
nVoltageCS: sheet PowerMeasure/nVoltageCS, sheet FPGA/nVoltageCS
Reserved_n: port Reserved_n, sheet FPGA/Reserved_n
Reserved_p: port Reserved_p, sheet FPGA/Reserved_p
Strobe_n: port Strobe_n, sheet FPGA/Strobe_n
Strobe_p: port Strobe_p, sheet FPGA/Strobe_p
ThermoSCL: sheet Misc/ThermoSCL, sheet FPGA/ThermoSCL
ThermoSDA: sheet Misc/ThermoSDA, sheet FPGA/ThermoSDA
VoltageDin: sheet PowerMeasure/VoltageDin, sheet FPGA/VoltageDin
VoltageDout: sheet PowerMeasure/VoltageDout, sheet FPGA/VoltageDout
VoltageSclk: sheet PowerMeasure/VoltageSclk, sheet FPGA/VoltageSclk

## Buses and harness runs
bus EthAddrSelect[8..1] = sheet Ethernet/EthAddrSelect[8..1]
bus EthAddrSelect[8..1] = sheet FPGA/EthAddrSelect[8..1]
bus EthRXD[3..0] = sheet Ethernet/EthRXD[3..0]
bus EthRXD[3..0] = sheet FPGA/RXD[3..0]
bus EthTXD[3..0] = sheet Ethernet/EthTXD[3..0]
bus EthTXD[3..0] = sheet FPGA/TXD[3..0]
bus FRAM_A[16..0] = sheet FPGA/FRAM_A[16..0]
bus FRAM_A[16..0] = sheet Nonvolatile RAM/FRAM_A[16..0]
bus FRAM_D[15..0] = sheet FPGA/FRAM_D[15..0]
bus FRAM_D[15..0] = sheet Nonvolatile RAM/FRAM_D[15..0]

## Layout directives
differential pair: Adc0_Clk_n, Adc0_Clk_p, Adc0_D0_n, Adc0_D0_p, Adc0_D1_n, Adc0_D1_p, Adc0_D2_n, Adc0_D2_p, Adc0_D3_n, Adc0_D3_p, Adc0_D4_n, Adc0_D4_p, Adc0_D5_n, Adc0_D5_p, Adc0_D6_n, Adc0_D6_p, Adc0_D7_n, Adc0_D7_p, Adc0_Dco_n, Adc0_Dco_p, Adc0_Fco_n, Adc0_Fco_p, Adc1_Clk_n, Adc1_Clk_p, Adc1_D0_n, Adc1_D0_p, Adc1_D1_n, Adc1_D1_p, Adc1_D2_n, Adc1_D2_p, Adc1_D3_n, Adc1_D3_p, Adc1_D4_n, Adc1_D4_p, Adc1_D5_n, Adc1_D5_p, Adc1_D6_n, Adc1_D6_p, Adc1_D7_n, Adc1_D7_p, Adc1_Dco_n, Adc1_Dco_p, Adc1_Fco_n, Adc1_Fco_p, Adc2_Clk_n, Adc2_Clk_p, Adc2_D0_n, Adc2_D0_p, Adc2_D1_n, Adc2_D1_p, Adc2_D2_n, Adc2_D2_p, Adc2_D3_n, Adc2_D3_p, Adc2_D4_n, Adc2_D4_p, Adc2_D5_n, Adc2_D5_p, Adc2_D6_n, Adc2_D6_p, Adc2_D7_n, Adc2_D7_p, Adc2_Dco_n, Adc2_Dco_p, Adc2_Fco_n, Adc2_Fco_p, Adc3_Clk_n, Adc3_Clk_p, Adc3_D0_n, Adc3_D0_p, Adc3_D1_n, Adc3_D1_p, Adc3_D2_n, Adc3_D2_p, Adc3_D3_n, Adc3_D3_p, Adc3_D4_n, Adc3_D4_p, Adc3_D5_n, Adc3_D5_p, Adc3_D6_n, Adc3_D6_p, Adc3_D7_n, Adc3_D7_p, Adc3_Dco_n, Adc3_Dco_p, Adc3_Fco_n, Adc3_Fco_p, ClkGen_RefClock_n, ClkGen_RefClock_p, Hit_n, Hit_p, Reserved_n, Reserved_p, Strobe_n, Strobe_p

## Notes on the sheet
- close to receiver
- Модуль регистрации - цифровая часть